# EAGLE schematic board_schematic (EAGLE 7.2.0)
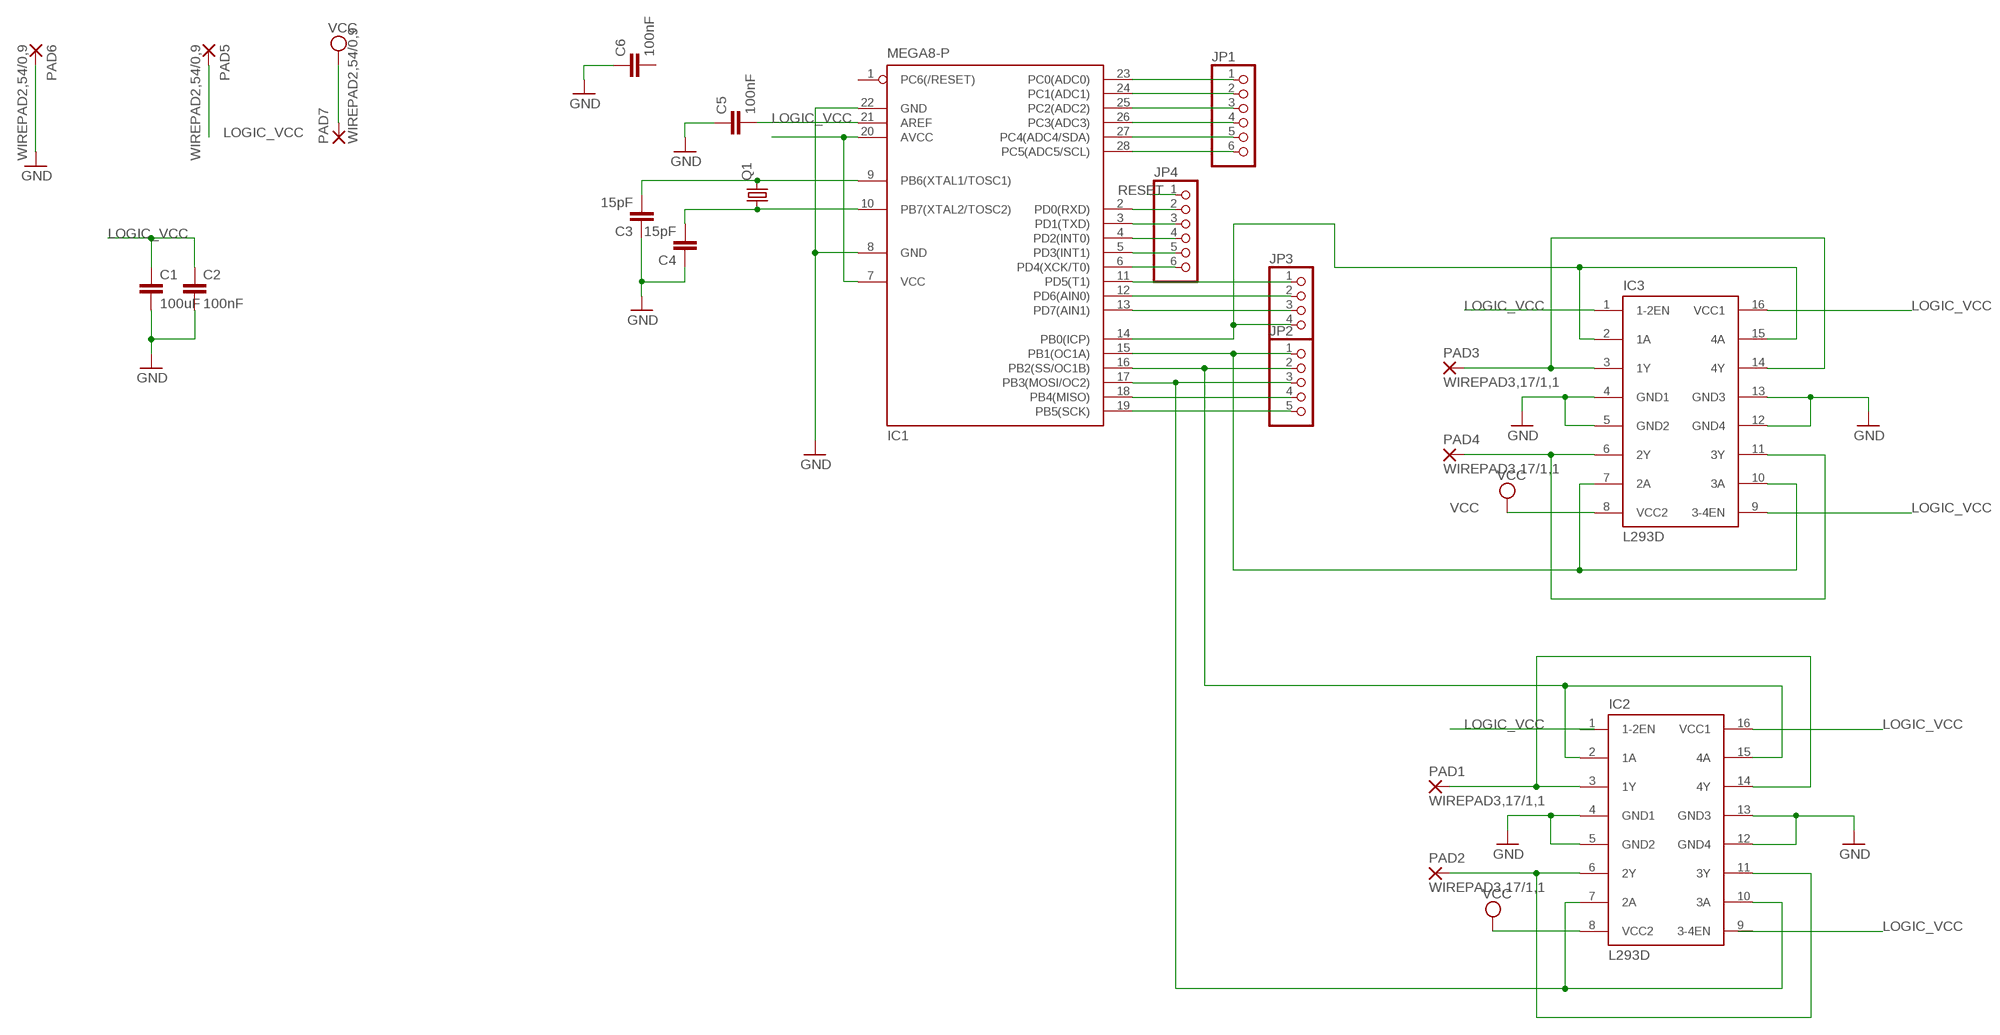
[diagram p0: schematic, sheet 1]

## Parts
C1  100uF  C-EU050-045X075  [C050-045X075]
C2  100nF  C-EU050-045X075  [C050-045X075]
C3  15pF  C5/2.5  [C5B2.5]
C4  15pF  C5/2.5  [C5B2.5]
C5  100nF  C-EU050-045X075  [C050-045X075]
C6  100nF  C-EU050-045X075  [C050-045X075]
IC1  MEGA8-P  [DIL28-3]
IC2  L293D  [DIL16]
IC3  L293D  [DIL16]
JP1  PINHD-1X6  [1X06]
JP2  PINHD-1X5  [1X05]
JP3  PINHD-1X4  [1X04]
JP4  PINHD-1X6  [1X06]
PAD1  WIREPAD3,17/1,1  [3,17/1,1]
PAD2  WIREPAD3,17/1,1  [3,17/1,1]
PAD3  WIREPAD3,17/1,1  [3,17/1,1]
PAD4  WIREPAD3,17/1,1  [3,17/1,1]
PAD5  WIREPAD2,54/0,9  [2,54/0,9]
PAD6  WIREPAD2,54/0,9  [2,54/0,9]
PAD7  WIREPAD2,54/0,9  [2,54/0,9]
Q1  CRYSTALHC49S  [HC49/S]

## Nets
GND: C1.2 C2.2 C3.1 C4.1 C5.1 C6.1 IC1.8(GND) IC1.22(GND) IC2.4(GND1) IC2.5(GND2) IC2.12(GND4) IC2.13(GND3) IC3.4(GND1) IC3.5(GND2) IC3.12(GND4) IC3.13(GND3) PAD6.1(P)
LOGIC_VCC: C1.1 C2.1 IC1.7(VCC) IC1.20(AVCC) IC2.16(VCC1) IC3.1(1-2EN) IC3.9(3-4EN) IC3.16(VCC1) PAD5.1(P)
N$1: IC3.3(1Y) IC3.14(4Y) PAD3.1(P)
N$2: IC1.15(PB1(OC1A)) IC3.7(2A) IC3.10(3A) JP2.1
N$3: IC2.3(1Y) IC2.14(4Y) PAD1.1(P)
N$4: IC1.16(PB2(SS/OC1B)) IC2.2(1A) IC2.15(4A) JP2.2
N$6: IC2.6(2Y) IC2.11(3Y) PAD2.1(P)
N$7: IC3.6(2Y) IC3.11(3Y) PAD4.1(P)
N$8: IC1.17(PB3(MOSI/OC2)) IC2.7(2A) IC2.10(3A) JP2.3
N$9: IC1.23(PC0(ADC0)) JP1.1
N$10: C3.2 IC1.9(PB6(XTAL1/TOSC1)) Q1.2
N$11: C4.2 IC1.10(PB7(XTAL2/TOSC2)) Q1.1
N$12: C5.2 IC1.21(AREF)
N$13: IC1.24(PC1(ADC1)) JP1.2
N$14: IC1.25(PC2(ADC2)) JP1.3
N$15: IC1.26(PC3(ADC3)) JP1.4
N$16: IC1.27(PC4(ADC4/SDA)) JP1.5
N$17: IC1.28(PC5(ADC5/SCL)) JP1.6
N$18: IC1.18(PB4(MISO)) JP2.4
N$19: IC1.19(PB5(SCK)) JP2.5
N$20: IC1.6(PD4(XCK/T0)) JP4.6
N$21: IC1.5(PD3(INT1)) JP4.5
N$22: IC1.4(PD2(INT0)) JP4.4
N$23: IC1.3(PD1(TXD)) JP4.3
N$24: IC1.2(PD0(RXD)) JP4.2
N$25: IC1.11(PD5(T1)) JP3.1
N$26: IC1.12(PD6(AIN0)) JP3.2
N$27: IC1.13(PD7(AIN1)) JP3.3
N$28: IC1.14(PB0(ICP)) IC3.2(1A) IC3.15(4A) JP3.4
RESET: JP4.1
VCC: IC2.8(VCC2) IC3.8(VCC2) PAD7.1(P)
Unconnected: C6.2 IC1.1(PC6(/RESET)) IC2.1(1-2EN) IC2.9(3-4EN)

## Library data of the parts
C1 C2 C5 C6 = rcl:C-EU: CAPACITOR, European symbol
C3 C4 = capacitor-wima:C: CAPACITOR naming: grid - package width
IC1 = atmel:MEGA8-P: MICROCONTROLLER 8 Kbytes FLASH, 1 kbytes SRAM, 512 bytes EEPROM, USART, 4-channel 10 bit ADC, 2-channel 8 bit ADC Pin compatible with Atmega48, ATMega88, ATMega168 Source: avr.lbr; OC_FARNELL: unknown; OC_NEWARK: unknown
IC2 IC3 = st-microelectronics:L293D: PUSH-PULL 4 CHANNEL DRIVER; MPN: L293D; OC_FARNELL: 9589619; OC_NEWARK: 56P8249
JP1 JP4 = pinhead:PINHD-1X6: PIN HEADER
JP2 = pinhead:PINHD-1X5: PIN HEADER
JP3 = pinhead:PINHD-1X4: PIN HEADER
PAD1-PAD7 = wirepad:WIREPAD: Wire PAD connect wire on PCB
Q1 = crystal:CRYSTAL: CRYSTAL; OC_FARNELL: 1667008; OC_NEWARK: unknown